# Altium schematic sheet 5_power.SchDoc: Power supply
size A4; OrganizationName: Pluton UPV; Address1: Universitat Politècnica; Address2: de València (UPV); Address3: Camí de Vera, València; Address4: Spain; SheetNumber: 6; SheetTotal: 6
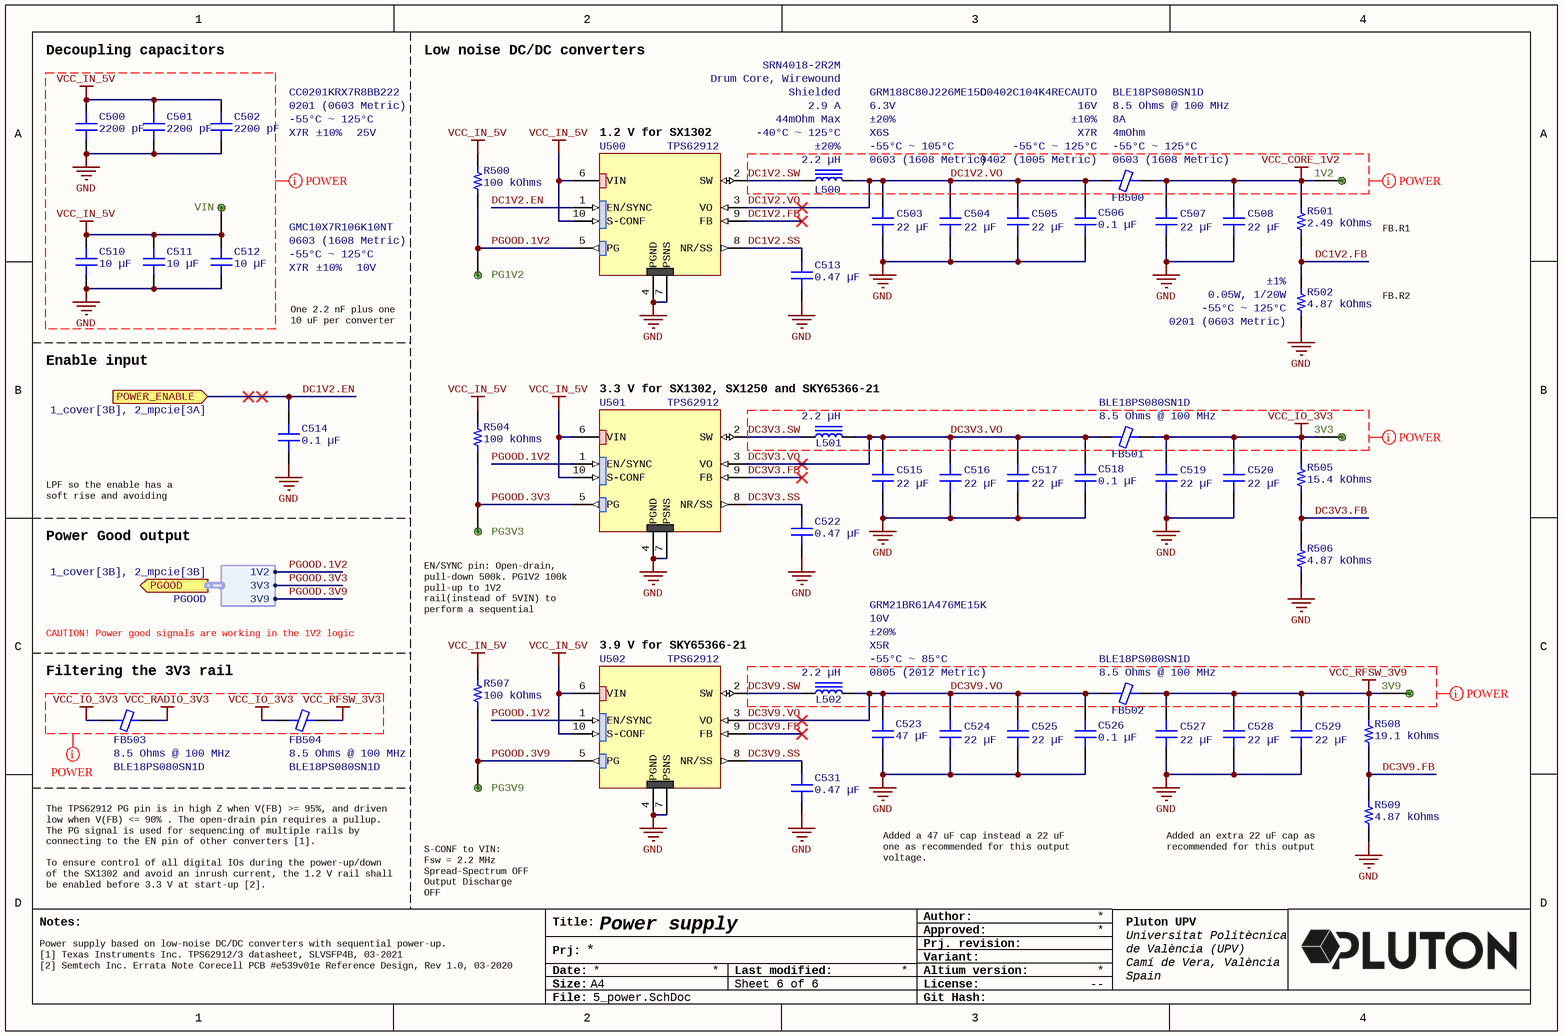
[diagram p0: 5_power.SchDoc]

## Parts
1V2  (no value)  [testpoint_via]  (no BOM)
3V3  (no value)  [testpoint_via]  (no BOM)
3V9  (no value)  [testpoint_via]  (no BOM)
C500  2200 pF  [CAP 0201_0603]
C501  2200 pF  [CAP 0201_0603]
C502  Part Number: CC0201KRX7R8BB222  Device Package: 0201 (0603 Metric)  Operating Temperature: -55°C ~ 125°C  Temperature Coefficient: X7R  Tolerance: ±10%  Voltage - Rated: 25V  [CAP 0201_0603]  (hidden comment: 2200 pF)
C503  Part Number: GRM188C80J226ME15D  Device Package: 0603 (1608 Metric)  Operating Temperature: -55°C ~ 105°C  Temperature Coefficient: X6S  Tolerance: ±20%  Voltage - Rated: 6.3V  [CAP 0603_1608]  (hidden comment: 22 µF)
C504  22 µF  [CAP 0603_1608]
C505  22 µF  [CAP 0603_1608]
C506  Part Number: C0402C104K4RECAUTO  Operating Temperature: -55°C ~ 125°C  Package / Case: 0402 (1005 Metric)  Temperature Coefficient: X7R  Tolerance: ±10%  Voltage - Rated: 16V  [CAP 0402_1005]  (hidden comment: 0.1 µF)
C507  22 µF  [CAP 0603_1608]
C508  22 µF  [CAP 0603_1608]
C510  10 µF  [CAP 0603_1608]
C511  10 µF  [CAP 0603_1608]
C512  Part Number: GMC10X7R106K10NT  Device Package: 0603 (1608 Metric)  Operating Temperature: -55°C ~ 125°C  Temperature Coefficient: X7R  Tolerance: ±10%  Voltage - Rated: 10V  [CAP 0603_1608]  (hidden comment: 10 µF)
C513  0.47 µF  [CAP 0402_1005]
C514  0.1 µF  [CAP 0402_1005]
C515  22 µF  [CAP 0603_1608]
C516  22 µF  [CAP 0603_1608]
C517  22 µF  [CAP 0603_1608]
C518  0.1 µF  [CAP 0402_1005]
C519  22 µF  [CAP 0603_1608]
C520  22 µF  [CAP 0603_1608]
C522  0.47 µF  [CAP 0402_1005]
C523  Part Number: GRM21BR61A476ME15K  Device Package: 0805 (2012 Metric)  Operating Temperature: -55°C ~ 85°C  Temperature Coefficient: X5R  Tolerance: ±20%  Voltage - Rated: 10V  [CAP 0805_2012]  (hidden comment: 47 µF)
C524  22 µF  [CAP 0603_1608]
C525  22 µF  [CAP 0603_1608]
C526  0.1 µF  [CAP 0402_1005]
C527  22 µF  [CAP 0603_1608]
C528  22 µF  [CAP 0603_1608]
C529  22 µF  [CAP 0603_1608]
C531  0.47 µF  [CAP 0402_1005]
FB500  Part Number: BLE18PS080SN1D  Current Rating (Max): 8A  DC Resistance (DCR) (Max): 4mOhm  Device Package: 0603 (1608 Metric)  Operating Temperature: -55°C ~ 125°C  [FER 0603_1608]  (hidden comment: 8.5 Ohms @ 100 MHz)
FB501  Part Number: BLE18PS080SN1D  [FER 0603_1608]  (hidden comment: 8.5 Ohms @ 100 MHz)
FB502  Part Number: BLE18PS080SN1D  [FER 0603_1608]  (hidden comment: 8.5 Ohms @ 100 MHz)
FB503  Part Number: BLE18PS080SN1D  [FER 0603_1608]  (hidden comment: 8.5 Ohms @ 100 MHz)
FB504  Part Number: BLE18PS080SN1D  [FER 0603_1608]  (hidden comment: 8.5 Ohms @ 100 MHz)
L500  2.2 µH  Part Number: SRN4018-2R2M  Current Rating (Amps): 2.9 A  DC Resistance (DCR): 44mOhm Max  Operating Temperature: -40°C ~ 125°C  Shielding: Shielded  Tolerance: ±20%  Type: Drum Core, Wirewound  [BOURNS SRN4018]
L501  2.2 µH  [BOURNS SRN4018]
L502  2.2 µH  [BOURNS SRN4018]
PG1V2  (no value)  [testpoint_via]  (no BOM)
PG3V3  (no value)  [testpoint_via]  (no BOM)
PG3V9  (no value)  [testpoint_via]  (no BOM)
R500  100 kOhms  [RES 0201_0603]
R501  2.49 kOhms  [RES 0201_0603]
R502  Device Package: 0201 (0603 Metric)  Operating Temperature: -55°C ~ 125°C  Power (Watts): 0.05W, 1/20W  Tolerance: ±1%  [RES 0201_0603]  (hidden comment: 4.87 kOhms)
R504  100 kOhms  [RES 0201_0603]
R505  15.4 kOhms  [RES 0201_0603]
R506  4.87 kOhms  [RES 0201_0603]
R507  100 kOhms  [RES 0201_0603]
R508  19.1 kOhms  [RES 0201_0603]
R509  4.87 kOhms  [RES 0201_0603]
U500  TPS62912  [VQFN-HR-TPS6291X]
U501  TPS62912  [VQFN-HR-TPS6291X]
U502  TPS62912  [VQFN-HR-TPS6291X]
VIN  (no value)  [testpoint_via]  (no BOM)

## Ports
PGOOD (out, harness PGOOD, see 1_cover[3B], 2_mpcie[3B]), POWER_ENABLE (in, see 1_cover[3B], 2_mpcie[3A])

## Harnesses
PGOOD: 1V2, 3V3, 3V9

## Nets
GND: C500.1 C501.1 C502.1 C503.1 C504.1 C505.1 C506.1 C507.1 C508.1 C510.1 C511.1 C512.1 C513.1 C514.1 C515.1 C516.1 C517.1 C518.1 C519.1 C520.1 C522.1 C523.1 C524.1 C525.1 C526.1 C527.1 C528.1 C529.1 C531.1 R502.1 R506.1 R509.1 U500.4(PGND) U500.7(PSNS) U501.4(PGND) U501.7(PSNS) U502.4(PGND) U502.7(PSNS)
VCC_CORE_1V2: 1V2.0 C507.2 C508.2 FB500.2 R501.2
VCC_IN_5V: C500.2 C501.2 C502.2 C510.2 C511.2 C512.2 R500.2 R504.2 R507.2 U500.6(VIN) U500.10(S-CONF) U501.6(VIN) U501.10(S-CONF) U502.6(VIN) U502.10(S-CONF) VIN.0
VCC_IO_3V3: 3V3.0 C519.2 C520.2 FB501.2 FB503.1 FB504.1 R505.2
VCC_RADIO_3V3: FB503.2
VCC_RFSW_3V3: FB504.2
VCC_RFSW_3V9: 3V9.0 C527.2 C528.2 C529.2 FB502.2 R508.2
DC1V2.EN: C514.2 U500.1(EN/SYNC) ; port POWER_ENABLE
DC1V2.FB: R501.1 R502.2 U500.9(FB)
DC1V2.SS: C513.2 U500.8(NR/SS)
DC1V2.SW: L500.1 U500.2(SW)
DC1V2.VO: C503.2 C504.2 C505.2 C506.2 FB500.1 L500.2 U500.3(VO)
DC3V3.FB: R505.1 R506.2 U501.9(FB)
DC3V3.SS: C522.2 U501.8(NR/SS)
DC3V3.SW: L501.1 U501.2(SW)
DC3V3.VO: C515.2 C516.2 C517.2 C518.2 FB501.1 L501.2 U501.3(VO)
DC3V9.FB: R508.1 R509.2 U502.9(FB)
DC3V9.SS: C531.2 U502.8(NR/SS)
DC3V9.SW: L502.1 U502.2(SW)
DC3V9.VO: C523.2 C524.2 C525.2 C526.2 FB502.1 L502.2 U502.3(VO)
PGOOD.1V2: PG1V2.0 R500.1 U500.5(PG) U501.1(EN/SYNC) U502.1(EN/SYNC) ; port PGOOD.1V2
PGOOD.3V3: PG3V3.0 R504.1 U501.5(PG) ; port PGOOD.3V3
PGOOD.3V9: PG3V9.0 R507.1 U502.5(PG) ; port PGOOD.3V9

## Layout directives
rule Width Constraint [Pref Width = 0.4mm    Min Width = 0.2mm    Max Width = 2mm]; net class POWER: DC1V2.SW, DC1V2.VO, DC3V3.SW, DC3V3.VO, DC3V9.SW, DC3V9.VO, GND, VCC_CORE_1V2, VCC_IN_5V, VCC_IO_3V3, VCC_RADIO_3V3, VCC_RFSW_3V3, VCC_RFSW_3V9

## Notes on the sheet
- Decoupling capacitors
- Low noise DC/DC converters
- (near U500) 1.2 V for SX1302
- FB.R1
- FB.R2
- Enable input
- One 2.2 nF plus one 10 uF per converter
- 3.3 V for SX1302, SX1250 and SKY65366-21
- LPF so the enable has a soft rise and avoiding glitches
- Power Good output
- CAUTION! Power good signals are working in the 1V2 logic voltage.
- EN/SYNC pin: Open-drain, pull-down 500k. PG1V2 100k pull-up to 1V2 rail(instead of 5VIN) to perform a sequential power-up
- (near U502) 3.9 V for SKY65366-21
- (near FB503) Filtering the 3V3 rail
- The TPS62912 PG pin is in high Z when V(FB) >= 95%, and driven low when V(FB) <= 90% . The open-drain pin requires a pullup. The PG signal is used for sequencing of multiple rails by connecting to the EN pin of other converters [1].
- (near R509) Added an extra 22 uF cap as recommended for this output voltage.
- To ensure control of all digital IOs during the power-up/down of the SX1302 and avoid an inrush current, the 1.2 V rail shall be enabled before 3.3 V at start-up [2].
- S-CONF to VIN:
  Fsw = 2.2 MHz
  Spread-Spectrum OFF
  Output Discharge OFF
  Sync OFF
- Added a 47 uF cap instead a 22 uF one as recommended for this output voltage.
- Power supply based on low-noise DC/DC converters with sequential power-up.
  [1] Texas Instruments Inc. TPS62912/3 datasheet, SLVSFP4B, 03-2021
  [2] Semtech Inc. Errata Note Corecell PCB #e539v01e Reference Design, Rev 1.0, 03-2020
- Notes:
- Title:
- Author:
- Approved:
- Date:
- Prj:
- Size:
- A4
- Last modified:
- Altium version:
- Variant:
- Prj. revision:
- License:
- --
- File:
- Git Hash:

## Library data of the parts
1V2 3V3 3V9 PG1V2 PG3V3 PG3V9 VIN = TestPoint-VIA: Test point, thru-hole
C500 C501 = CC0201KRX7R8BB222: CAP CER 2200PF 25V X7R 0201; manufacturer: Yageo; Tolerance: ±10%; Part Number: CC0201KRX7R8BB222; Value: 2200 pF; Applications: General Purpose; Capacitance: 2200 pF; componentlink1description: Datasheet; componentlink1url: https://www.yageo.com/upload/media/product/productsearch/datasheet/mlcc/UPY-GPHC_X7R_6.3V-to-250V_22.pdf; componentlink2description: DigiKey Link; componentlink2url: https://www.digikey.com/en/products/detail/yageo/CC0201KRX7R8BB222/11490225; Device Package: 0201 (0603 Metric); lastupdated: 04/06/2024 19:00:56; Lifecycle Status: Active; Minimum Order: 1; Mounting Type: Surface Mount, MLCC; Operating Temperature: -55°C ~ 125°C; Package / Case: 0201 (0603 Metric); packaging: CutTape; partid: 52408; Part Status: Active; price: 0.01; series: CC; Size / Dimension: 0.024" L x 0.012" W (0.60mm x 0.30mm); Supplier 1: DigiKey; Supplier Part Number 1: 13-CC0201KRX7R8BB222CT-ND; Temperature Coefficient: X7R; Thickness (Max): 0.013" (0.33mm); Voltage - Rated: 25V
C502 = CC0201KRX7R8BB222: CAP CER 2200PF 25V X7R 0201; manufacturer: Yageo; Value: 2200 pF; Applications: General Purpose; Capacitance: 2200 pF; componentlink1description: Datasheet; componentlink1url: https://www.yageo.com/upload/media/product/productsearch/datasheet/mlcc/UPY-GPHC_X7R_6.3V-to-250V_22.pdf; componentlink2description: DigiKey Link; componentlink2url: https://www.digikey.com/en/products/detail/yageo/CC0201KRX7R8BB222/11490225; lastupdated: 04/06/2024 19:00:56; Lifecycle Status: Active; Minimum Order: 1; Mounting Type: Surface Mount, MLCC; Package / Case: 0201 (0603 Metric); packaging: CutTape; partid: 52408; Part Status: Active; price: 0.01; series: CC; Size / Dimension: 0.024" L x 0.012" W (0.60mm x 0.30mm); Supplier 1: DigiKey; Supplier Part Number 1: 13-CC0201KRX7R8BB222CT-ND; Thickness (Max): 0.013" (0.33mm)
C503 = GRM188C80J226ME15D: CAP CER 22UF 6.3V X6S 0603; manufacturer: Murata Electronics; Value: 22 µF; Applications: General Purpose; Capacitance: 22 µF; componentlink1description: Datasheet; componentlink1url: https://search.murata.co.jp/Ceramy/image/img/A01X/G101/ENG/GRM188C80J226ME15-01.pdf; componentlink2description: DigiKey Link; componentlink2url: https://www.digikey.com/en/products/detail/murata-electronics/GRM188C80J226ME15D/5027556; lastupdated: 09/02/2024 20:10:26; Lifecycle Status: Active; Minimum Order: 1; Mounting Type: Surface Mount, MLCC; Package / Case: 0603 (1608 Metric); packaging: TapeAndReel; partid: 39580; Part Status: Active; price: 0.03; series: GRM; Size / Dimension: 0.063" L x 0.031" W (1.60mm x 0.80mm); Supplier 1: DigiKey; Supplier Part Number 1: 490-10471-1-ND; Thickness (Max): 0.039" (1.00mm)
C504 C505 C507 C508 C515-C517 C519 C520 C524 C525 C527-C529 = GRM188C80J226ME15D: CAP CER 22UF 6.3V X6S 0603; manufacturer: Murata Electronics; Tolerance: ±20%; Part Number: GRM188C80J226ME15D; Value: 22 µF; Applications: General Purpose; Capacitance: 22 µF; componentlink1description: Datasheet; componentlink1url: https://search.murata.co.jp/Ceramy/image/img/A01X/G101/ENG/GRM188C80J226ME15-01.pdf; componentlink2description: DigiKey Link; componentlink2url: https://www.digikey.com/en/products/detail/murata-electronics/GRM188C80J226ME15D/5027556; Device Package: 0603 (1608 Metric); lastupdated: 09/02/2024 20:10:26; Lifecycle Status: Active; Minimum Order: 1; Mounting Type: Surface Mount, MLCC; Operating Temperature: -55°C ~ 105°C; Package / Case: 0603 (1608 Metric); packaging: TapeAndReel; partid: 39580; Part Status: Active; price: 0.03; series: GRM; Size / Dimension: 0.063" L x 0.031" W (1.60mm x 0.80mm); Supplier 1: DigiKey; Supplier Part Number 1: 490-10471-1-ND; Temperature Coefficient: X6S; Thickness (Max): 0.039" (1.00mm); Voltage - Rated: 6.3V
C506 C514 C518 C526 = C0402C104K4RECAUTO: CAP CER 0402 0.1UF 16V X7R 10%; manufacturer: KEMET; Value: 0.1 µF; Applications: Automotive, ESD Protection; Capacitance: 0.1 µF; componentlink1description: Datasheet; componentlink1url: https://api.kemet.com/component-edge/download/datasheet/C0402C104K4RECAUTO.pdf; componentlink2description: DigiKey Link; componentlink2url: https://www.digikey.com/en/products/detail/kemet/C0402C104K4RECAUTO/8563695; Device Package: 0402 (1005 Metric); lastupdated: 09/02/2024 20:04:38; Lifecycle Status: Active; Minimum Order: 1; Mounting Type: Surface Mount, MLCC; packaging: TapeAndReel; partid: 1731; Part Status: Active; price: 0.01; Ratings: AEC-Q200; series: ESD SMD Auto X7R; Size / Dimension: 0.039" L x 0.020" W (1.00mm x 0.50mm); Supplier 1: DigiKey; Supplier Part Number 1: 399-17167-1-ND; Thickness (Max): 0.022" (0.55mm)
  C514 C518 C526: Part Number: C0402C104K4RECAUTO; Operating Temperature: -55°C ~ 125°C; Package / Case: 0402 (1005 Metric); Temperature Coefficient: X7R; Tolerance: ±10%; Voltage - Rated: 16V
C510-C512 = GMC10X7R106K10NT: CAP0603 X7R 10UF 10% 10V; manufacturer: Cal-Chip Electronics, Inc.; Value: 10 µF; Applications: General Purpose; Capacitance: 10 µF; componentlink1description: Datasheet; componentlink1url: https://88ce57.p3cdn1.secureserver.net/wp-content/uploads/2023/01/gmc_series-2.pdf; componentlink2description: DigiKey Link; componentlink2url: https://www.digikey.com/en/products/detail/cal-chip-electronics-inc/GMC10X7R106K10NT/18151126; lastupdated: 09/02/2024 20:09:39; Lifecycle Status: Active; Minimum Order: 1; Mounting Type: Surface Mount, MLCC; Package / Case: 0603 (1608 Metric); packaging: TapeAndReel; partid: 49835; Part Status: Active; price: 0.26; series: GMC; Size / Dimension: 0.063" L x 0.031" W (1.60mm x 0.80mm); Supplier 1: DigiKey; Supplier Part Number 1: 4713-GMC10X7R106K10NTCT-ND; Thickness (Max): 0.039" (1.00mm)
  C510 C511: Part Number: GMC10X7R106K10NT; Device Package: 0603 (1608 Metric); Operating Temperature: -55°C ~ 125°C; Temperature Coefficient: X7R; Tolerance: ±10%; Voltage - Rated: 10V
C513 C522 C531 = CGA2B1X7S1C474K050BC: CAP CER 0.47UF 16V X7S 0402; manufacturer: TDK Corporation; Tolerance: ±10%; Part Number: CGA2B1X7S1C474K050BC; Value: 0.47 µF; Applications: Automotive; Capacitance: 0.47 µF; componentlink1description: Datasheet; componentlink1url: https://product.tdk.com/info/en/catalog/datasheets/mlcc_automotive_general_en.pdf?ref_disty=digikey; componentlink2description: DigiKey Link; componentlink2url: https://www.digikey.com/en/products/detail/tdk-corporation/CGA2B1X7S1C474K050BC/4931442; Device Package: 0402 (1005 Metric); lastupdated: 09/02/2024 20:04:28; Lifecycle Status: Active; Minimum Order: 1; Mounting Type: Surface Mount, MLCC; Operating Temperature: -55°C ~ 125°C; Package / Case: 0402 (1005 Metric); packaging: TapeAndReel; partid: 7602; Part Status: Active; price: 0.03; Ratings: AEC-Q200; series: CGA; Size / Dimension: 0.039" L x 0.020" W (1.00mm x 0.50mm); Supplier 1: DigiKey; Supplier Part Number 1: 445-174214-1-ND; Temperature Coefficient: X7S; Thickness (Max): 0.022" (0.55mm); Voltage - Rated: 16V
C523 = GRM21BR61A476ME15K: CAP CER 47UF 10V X5R 0805; manufacturer: Murata Electronics; Value: 47 µF; Applications: General Purpose; Capacitance: 47 µF; componentlink1description: Datasheet; componentlink1url: https://www.murata.com/-/media/webrenewal/support/library/catalog/products/capacitor/ceramiccapacitor/c02e.ashx?la=en-us&cvid=20210120024548000000; componentlink2description: DigiKey Link; componentlink2url: https://www.digikey.com/en/products/detail/murata-electronics/GRM21BR61A476ME15K/4905528; lastupdated: 09/02/2024 20:14:59; Lifecycle Status: Active; Minimum Order: 1; Mounting Type: Surface Mount, MLCC; Package / Case: 0805 (2012 Metric); packaging: TapeAndReel; partid: 44285; Part Status: Active; price: 0.13; series: GRM; Size / Dimension: 0.079" L x 0.049" W (2.00mm x 1.25mm); Supplier 1: DigiKey; Supplier Part Number 1: 490-GRM21BR61A476ME15KCT-ND; Thickness (Max): 0.057" (1.45mm)
FB500 = BLE18PS080SN1D: FERRITE BEAD 8.5 OHM 0603 1LN; Manufacturer: Murata Electronics; Filter Type: Power Line; Number of Lines: 1; ComponentLink1Description: Datasheet; ComponentLink1URL: https://www.murata.com/products/productdata/8800169525278/ENFA0080.pdf; ComponentLink2Description: DigiKey Link; ComponentLink2URL: https://www.digikey.com/en/products/detail/murata-electronics/BLE18PS080SN1D/13904803; Height (Max): 0.030" (0.75mm); Impedance @ Frequency: 8.5 Ohms @ 100 MHz; LastUpdated: 03/06/2024 19:51:46; Lifecycle Status: Active; Minimum Order: 1; Mounting Type: Surface Mount; Package / Case: 0603 (1608 Metric); Packaging: TapeAndReel; PartId: 2651; Part Status: Active; Price: 0.08; Series: EMIFIL®, BLE18; Size / Dimension: 0.063" L x 0.031" W (1.60mm x 0.80mm); Supplier 1: DigiKey; Supplier Part Number 1: 490-BLE18PS080SN1DCT-ND; Value: 8.5 Ohms @ 100 MHz
FB501-FB504 = BLE18PS080SN1D: FERRITE BEAD 8.5 OHM 0603 1LN; Manufacturer: Murata Electronics; Current Rating (Max): 8A; DC Resistance (DCR) (Max): 4mOhm; Filter Type: Power Line; Number of Lines: 1; ComponentLink1Description: Datasheet; ComponentLink1URL: https://www.murata.com/products/productdata/8800169525278/ENFA0080.pdf; ComponentLink2Description: DigiKey Link; ComponentLink2URL: https://www.digikey.com/en/products/detail/murata-electronics/BLE18PS080SN1D/13904803; Device Package: 0603 (1608 Metric); Height (Max): 0.030" (0.75mm); Impedance @ Frequency: 8.5 Ohms @ 100 MHz; LastUpdated: 03/06/2024 19:51:46; Lifecycle Status: Active; Minimum Order: 1; Mounting Type: Surface Mount; Operating Temperature: -55°C ~ 125°C; Package / Case: 0603 (1608 Metric); Packaging: TapeAndReel; PartId: 2651; Part Status: Active; Price: 0.08; Series: EMIFIL®, BLE18; Size / Dimension: 0.063" L x 0.031" W (1.60mm x 0.80mm); Supplier 1: DigiKey; Supplier Part Number 1: 490-BLE18PS080SN1DCT-ND; Value: 8.5 Ohms @ 100 MHz
L500 = SRN4018-2R2M: FIXED IND 2.2UH 2.9A 44 MOHM SMD; Manufacturer: Bourns Inc.; Current - Saturation: 3A; Frequency - Self Resonant: 60MHz; Inductance Frequency - Test: 100 kHz; Material - Core: Ferrite; Q @ Freq: 9 @ 7.96MHz; ComponentLink1Description: Datasheet; ComponentLink1URL: https://www.bourns.com/docs/Product-Datasheets/SRN4018.pdf; ComponentLink2Description: DigiKey Link; ComponentLink2URL: https://www.digikey.com/en/products/detail/bourns-inc/SRN4018-2R2M/3821619; Device Package: Nonstandard; Height - Seated (Max): 0.071" (1.80mm); Inductance: 2.2 µH; LastUpdated: 03/06/2024 20:24:37; Lifecycle Status: Active; Minimum Order: 1; Mounting Type: Surface Mount; Package / Case: Nonstandard; Packaging: TapeAndReel; PartId: 3660; Part Status: Active; Price: 0.17; Series: SRN4018; Size / Dimension: 0.157" L x 0.157" W (4.00mm x 4.00mm); Supplier 1: DigiKey; Supplier Part Number 1: SRN4018-2R2MCT-ND; Value: 2.2 µH
L501 L502 = SRN4018-2R2M: FIXED IND 2.2UH 2.9A 44 MOHM SMD; Manufacturer: Bourns Inc.; Current - Saturation: 3A; DC Resistance (DCR): 44mOhm Max; Frequency - Self Resonant: 60MHz; Inductance Frequency - Test: 100 kHz; Material - Core: Ferrite; Q @ Freq: 9 @ 7.96MHz; Shielding: Shielded; Tolerance: ±20%; Type: Drum Core, Wirewound; Part Number: SRN4018-2R2M; ComponentLink1Description: Datasheet; ComponentLink1URL: https://www.bourns.com/docs/Product-Datasheets/SRN4018.pdf; ComponentLink2Description: DigiKey Link; ComponentLink2URL: https://www.digikey.com/en/products/detail/bourns-inc/SRN4018-2R2M/3821619; Current Rating (Amps): 2.9 A; Device Package: Nonstandard; Height - Seated (Max): 0.071" (1.80mm); Inductance: 2.2 µH; LastUpdated: 03/06/2024 20:24:37; Lifecycle Status: Active; Minimum Order: 1; Mounting Type: Surface Mount; Operating Temperature: -40°C ~ 125°C; Package / Case: Nonstandard; Packaging: TapeAndReel; PartId: 3660; Part Status: Active; Price: 0.17; Series: SRN4018; Size / Dimension: 0.157" L x 0.157" W (4.00mm x 4.00mm); Supplier 1: DigiKey; Supplier Part Number 1: SRN4018-2R2MCT-ND; Value: 2.2 µH
R500 R504 R507 = RC0201FR-13100KL: RES 100K OHM 1% 1/20W 0201; Manufacturer: Yageo; Power (Watts): 0.05W, 1/20W; Temperature Coefficient: ±200ppm/°C; Part Number: RC0201FR-13100KL; Value: 100 kOhms; ComponentLink1Description: Datasheet; ComponentLink1URL: https://www.yageo.com/upload/media/product/productsearch/datasheet/rchip/PYu-RC_Group_51_RoHS_L_12.pdf; ComponentLink2Description: DigiKey Link; ComponentLink2URL: https://www.digikey.com/en/products/detail/yageo/RC0201FR-13100KL/17014509; Composition: Thick Film; Device Package: 0201 (0603 Metric); Features: Moisture Resistant; Height - Seated (Max): 0.010" (0.26mm); LastUpdated: 04/06/2024 19:11:47; Lifecycle Status: Active; Minimum Order: 1; Number of Terminations: 2; Operating Temperature: -55°C ~ 125°C; Package / Case: 0201 (0603 Metric); Packaging: CutTape; PartId: 80199; Price: 0.01; Resistance: 100 kOhms; Series: RC_L; Size / Dimension: 0.024" L x 0.012" W (0.60mm x 0.30mm); Supplier 1: DigiKey; Supplier Part Number 1: 13-RC0201FR-13100KLCT-ND; Supplier Device Package: 0201; Tolerance: ±1%
R501 = AC0201FR-072K49L: RES SMD 2.49K OHM 1% 1/20W 0201; Manufacturer: Yageo; Power (Watts): 0.05W, 1/20W; Temperature Coefficient: ±200ppm/°C; Part Number: AC0201FR-072K49L; Value: 2.49 kOhms; ComponentLink1Description: Datasheet; ComponentLink1URL: https://www.yageo.com/upload/media/product/productsearch/datasheet/rchip/PYu-AC_51_RoHS_L_7.pdf; ComponentLink2Description: DigiKey Link; ComponentLink2URL: https://www.digikey.com/en/products/detail/yageo/AC0201FR-072K49L/5894499; Composition: Thick Film; Device Package: 0201 (0603 Metric); Features: Automotive AEC-Q200, Moisture Resistant; Height - Seated (Max): 0.010" (0.26mm); LastUpdated: 04/06/2024 19:11:59; Lifecycle Status: Active; Minimum Order: 1; Number of Terminations: 2; Operating Temperature: -55°C ~ 155°C; Package / Case: 0201 (0603 Metric); Packaging: TapeAndReel; PartId: 986; Part Status: Active; Price: 0.01; Ratings: AEC-Q200; Resistance: 2.49 kOhms; Series: AC; Size / Dimension: 0.024" L x 0.012" W (0.60mm x 0.30mm); Supplier 1: DigiKey; Supplier Part Number 1: YAG5189CT-ND; Supplier Device Package: 0201; Tolerance: ±1%
R502 = RC0201FR-074K87L: RES 4.87K OHM 1% 1/20W 0201; Manufacturer: Yageo; Temperature Coefficient: ±200ppm/°C; Part Number: RC0201FR-074K87L; Value: 4.87 kOhms; ComponentLink1Description: Datasheet; ComponentLink1URL: https://www.yageo.com/upload/media/product/productsearch/datasheet/rchip/PYu-RC_Group_51_RoHS_L_10.pdf; ComponentLink2Description: DigiKey Link; ComponentLink2URL: https://www.digikey.com/en/products/detail/yageo/RC0201FR-074K87L/5280571; Composition: Thick Film; Features: Moisture Resistant; Height - Seated (Max): 0.010" (0.26mm); LastUpdated: 04/06/2024 19:11:58; Lifecycle Status: Active; Minimum Order: 1; Number of Terminations: 2; Package / Case: 0201 (0603 Metric); Packaging: TapeAndReel; PartId: 1350; Part Status: Active; Price: 0.01; Resistance: 4.87 kOhms; Series: RC_L; Size / Dimension: 0.024" L x 0.012" W (0.60mm x 0.30mm); Supplier 1: DigiKey; Supplier Part Number 1: YAG2711CT-ND; Supplier Device Package: 0201
R505 = RC0201FR-0715K4L: RES 15.4K OHM 1% 1/20W 0201; Manufacturer: Yageo; Power (Watts): 0.05W, 1/20W; Temperature Coefficient: ±200ppm/°C; Part Number: RC0201FR-0715K4L; Value: 15.4 kOhms; ComponentLink1Description: Datasheet; ComponentLink1URL: https://www.yageo.com/upload/media/product/productsearch/datasheet/rchip/PYu-RC_Group_51_RoHS_L_10.pdf; ComponentLink2Description: DigiKey Link; ComponentLink2URL: https://www.digikey.com/en/products/detail/yageo/RC0201FR-0715K4L/5280281; Composition: Thick Film; Device Package: 0201 (0603 Metric); Features: Moisture Resistant; Height - Seated (Max): 0.010" (0.26mm); LastUpdated: 04/06/2024 19:12:00; Lifecycle Status: Active; Minimum Order: 1; Number of Terminations: 2; Operating Temperature: -55°C ~ 125°C; Package / Case: 0201 (0603 Metric); Packaging: TapeAndReel; PartId: 714; Part Status: Active; Price: 0.01; Resistance: 15.4 kOhms; Series: RC_L; Size / Dimension: 0.024" L x 0.012" W (0.60mm x 0.30mm); Supplier 1: DigiKey; Supplier Part Number 1: YAG2421CT-ND; Supplier Device Package: 0201; Tolerance: ±1%
R506 R509 = RC0201FR-074K87L: RES 4.87K OHM 1% 1/20W 0201; Manufacturer: Yageo; Power (Watts): 0.05W, 1/20W; Temperature Coefficient: ±200ppm/°C; Part Number: RC0201FR-074K87L; Value: 4.87 kOhms; ComponentLink1Description: Datasheet; ComponentLink1URL: https://www.yageo.com/upload/media/product/productsearch/datasheet/rchip/PYu-RC_Group_51_RoHS_L_10.pdf; ComponentLink2Description: DigiKey Link; ComponentLink2URL: https://www.digikey.com/en/products/detail/yageo/RC0201FR-074K87L/5280571; Composition: Thick Film; Device Package: 0201 (0603 Metric); Features: Moisture Resistant; Height - Seated (Max): 0.010" (0.26mm); LastUpdated: 04/06/2024 19:11:58; Lifecycle Status: Active; Minimum Order: 1; Number of Terminations: 2; Operating Temperature: -55°C ~ 125°C; Package / Case: 0201 (0603 Metric); Packaging: TapeAndReel; PartId: 1350; Part Status: Active; Price: 0.01; Resistance: 4.87 kOhms; Series: RC_L; Size / Dimension: 0.024" L x 0.012" W (0.60mm x 0.30mm); Supplier 1: DigiKey; Supplier Part Number 1: YAG2711CT-ND; Supplier Device Package: 0201; Tolerance: ±1%
R508 = RC0201FR-0719K1L: RES 19.1K OHM 1% 1/20W 0201; Manufacturer: Yageo; Power (Watts): 0.05W, 1/20W; Temperature Coefficient: ±200ppm/°C; Part Number: RC0201FR-0719K1L; Value: 19.1 kOhms; ComponentLink1Description: Datasheet; ComponentLink1URL: https://www.yageo.com/upload/media/product/productsearch/datasheet/rchip/PYu-RC_Group_51_RoHS_L_10.pdf; ComponentLink2Description: DigiKey Link; ComponentLink2URL: https://www.digikey.com/en/products/detail/yageo/RC0201FR-0719K1L/5280324; Composition: Thick Film; Device Package: 0201 (0603 Metric); Features: Moisture Resistant; Height - Seated (Max): 0.010" (0.26mm); LastUpdated: 04/06/2024 19:11:59; Lifecycle Status: Active; Minimum Order: 1; Number of Terminations: 2; Operating Temperature: -55°C ~ 125°C; Package / Case: 0201 (0603 Metric); Packaging: TapeAndReel; PartId: 1027; Part Status: Active; Price: 0.01; Resistance: 19.1 kOhms; Series: RC_L; Size / Dimension: 0.024" L x 0.012" W (0.60mm x 0.30mm); Supplier 1: DigiKey; Supplier Part Number 1: YAG2464CT-ND; Supplier Device Package: 0201; Tolerance: ±1%
U500-U502 = TPS62912: 3-V to 17-V, 2-A/3-A Low Noise and Low Ripple Buck Converter with Integrated Ferrite Bead Filter Compensation